# Altium schematic sheet mcu.SchDoc
size A4
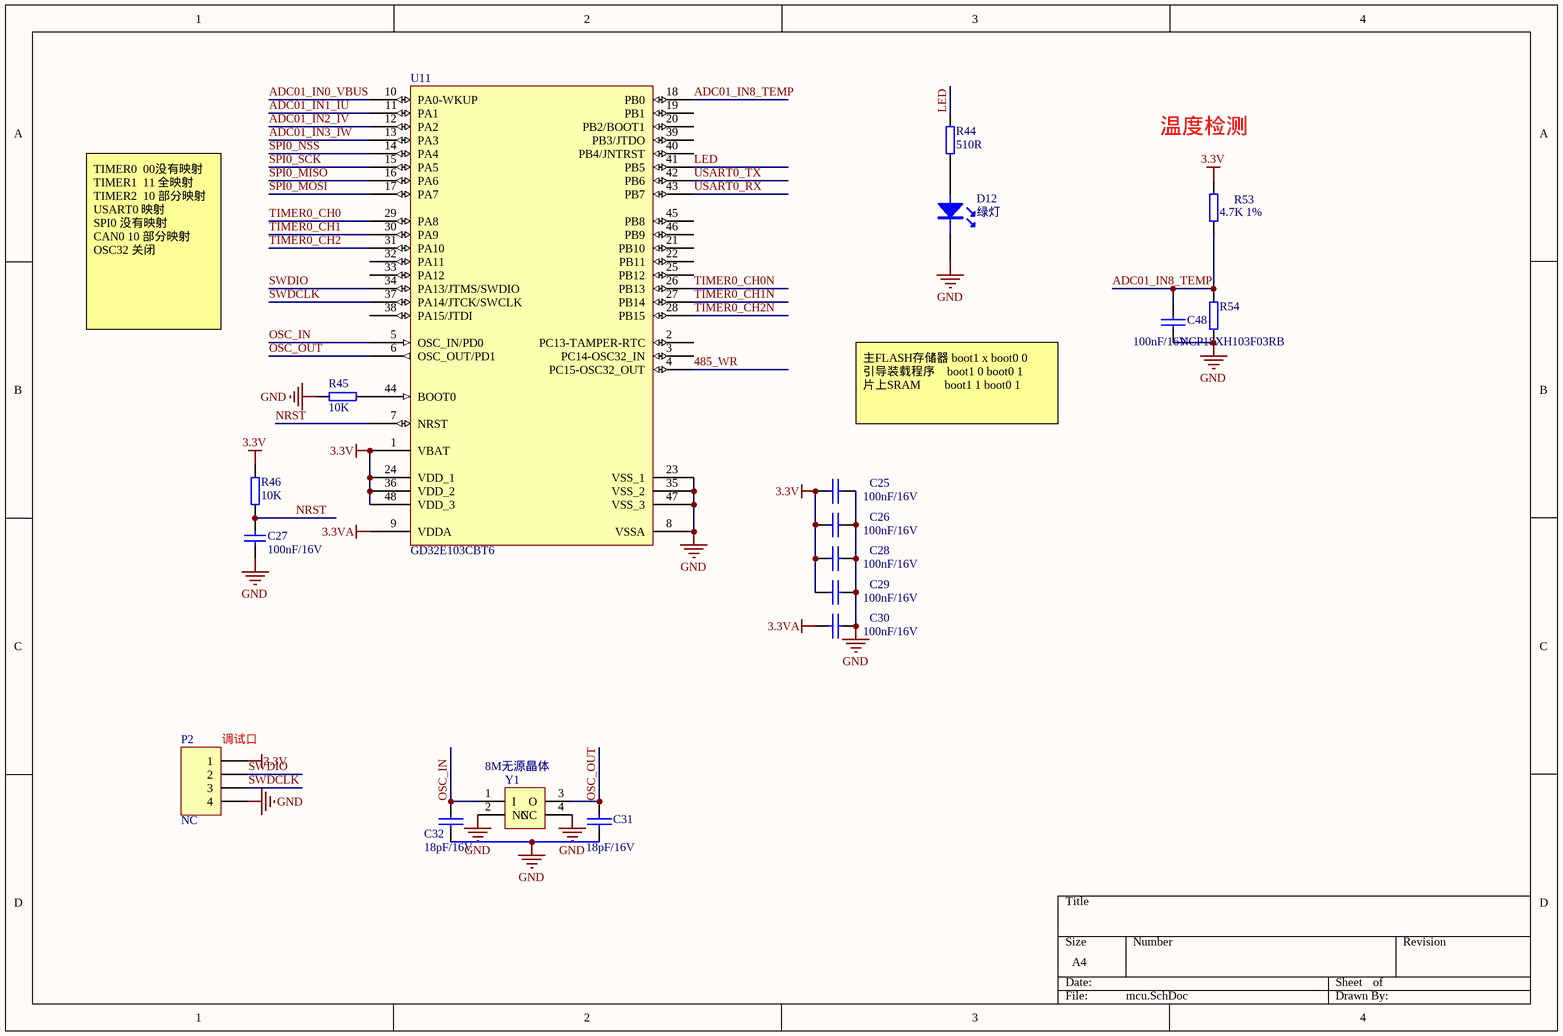
[diagram p0: mcu.SchDoc]

## Parts
C25  100nF/16V  [C0402]
C26  100nF/16V  [C0402]
C27  100nF/16V  [C0402]
C28  100nF/16V  [C0402]
C29  100nF/16V  [C0402]
C30  100nF/16V  [C0402]
C31  18pF/16V  [C0402]
C32  18pF/16V  [C0402]
C48  100nF/16V  [C0402]
D12  绿灯  [LED_0603]
P2  NC  [2.0*4]
R44  510R  [R0402]
R45  10K  [R0402]
R46  10K  [R0402]
R53  4.7K 1%  [R0402]
R54  NCP18XH103F03RB  [R0603]
U11  GD32E103CBT6  [LQFP-48]
Y1  8M无源晶体  [5032 4pin]

## Nets
3.3V: C25.2 C26.2 C28.2 C29.2 P2.1 R46.2 R53.2 U11.1(VBAT) U11.24(VDD_1) U11.36(VDD_2) U11.48(VDD_3)
3.3VA: C30.2 U11.9(VDDA)
GND: C25.1 C26.1 C27.1 C28.1 C29.1 C30.1 C31.1 C32.1 C48.2 D12.2(K) P2.4 R45.1 R54.1 U11.8(VSSA) U11.23(VSS_1) U11.35(VSS_2) U11.47(VSS_3) Y1.2(NC) Y1.4(NC)
485_WR: U11.4(PC15-OSC32_OUT)
ADC01_IN0_VBUS: U11.10(PA0-WKUP)
ADC01_IN1_IU: U11.11(PA1)
ADC01_IN2_IV: U11.12(PA2)
ADC01_IN3_IW: U11.13(PA3)
ADC01_IN8_TEMP: C48.1 R53.1 R54.2 U11.18(PB0)
LED: R44.1 U11.41(PB5)
NRST: C27.2 R46.1 U11.7(NRST)
OSC_IN: C32.2 U11.5(OSC_IN/PD0) Y1.1(I)
OSC_OUT: C31.2 U11.6(OSC_OUT/PD1) Y1.3(O)
SPI0_MISO: U11.16(PA6)
SPI0_MOSI: U11.17(PA7)
SPI0_NSS: U11.14(PA4)
SPI0_SCK: U11.15(PA5)
SWDCLK: P2.3 U11.37(PA14/JTCK/SWCLK)
SWDIO: P2.2 U11.34(PA13/JTMS/SWDIO)
TIMER0_CH0: U11.29(PA8)
TIMER0_CH0N: U11.26(PB13)
TIMER0_CH1: U11.30(PA9)
TIMER0_CH1N: U11.27(PB14)
TIMER0_CH2: U11.31(PA10)
TIMER0_CH2N: U11.28(PB15)
USART0_RX: U11.43(PB7)
USART0_TX: U11.42(PB6)
NetD12_1: D12.1(A) R44.2
NetR45_2: R45.2 U11.44(BOOT0)

Not connected (* = marked no-connect by the designer): U11 2(PC13-TAMPER-RTC) 3(PC14-OSC32_IN) 19(PB1) 20(PB2/BOOT1) 21(PB10) 22(PB11) 25(PB12) 32(PA11) 33(PA12) 38(PA15/JTDI) 39(PB3/JTDO) 40(PB4/JNTRST) 45(PB8) 46(PB9)

## Notes on the sheet
- 温度检测
- TIMER0  00没有映射
  TIMER1  11 全映射
  TIMER2  10 部分映射
  USART0 映射
  SPI0 没有映射
  CAN0 10 部分映射
  OSC32 关闭
- 主FLASH存储器 boot1 x boot0 0
  引导装载程序    boot1 0 boot0 1
  片上SRAM        boot1 1 boot0 1
- (near P2) 调试口

## Library data of the parts
C25 C26 C28-C32 C48 = CAP: Capacitor
C27 = cap
D12 = LED: 绿灯led
P2 = 排针2mm,1*4: 空，无器件; LatestRevisionDate: 17-Jul-2002; LatestRevisionNote: Re-released for DXP Platform.; Publisher: Altium Limited
R44 R53 R54 = R
R45 R46 = Resistance
U11 = GD32E103CxT6: Published: *; DatasheetVersion: *; PackageVersion: *; PackageReference: *; Publisher: *; PackageDescription: *; ComponentLink1Description: *; ComponentLink1URL: *; ComponentLink2Description: *; ComponentLink2URL: *
Y1 = OSC24